# Altium project M-Watch_Project.PrjPcb
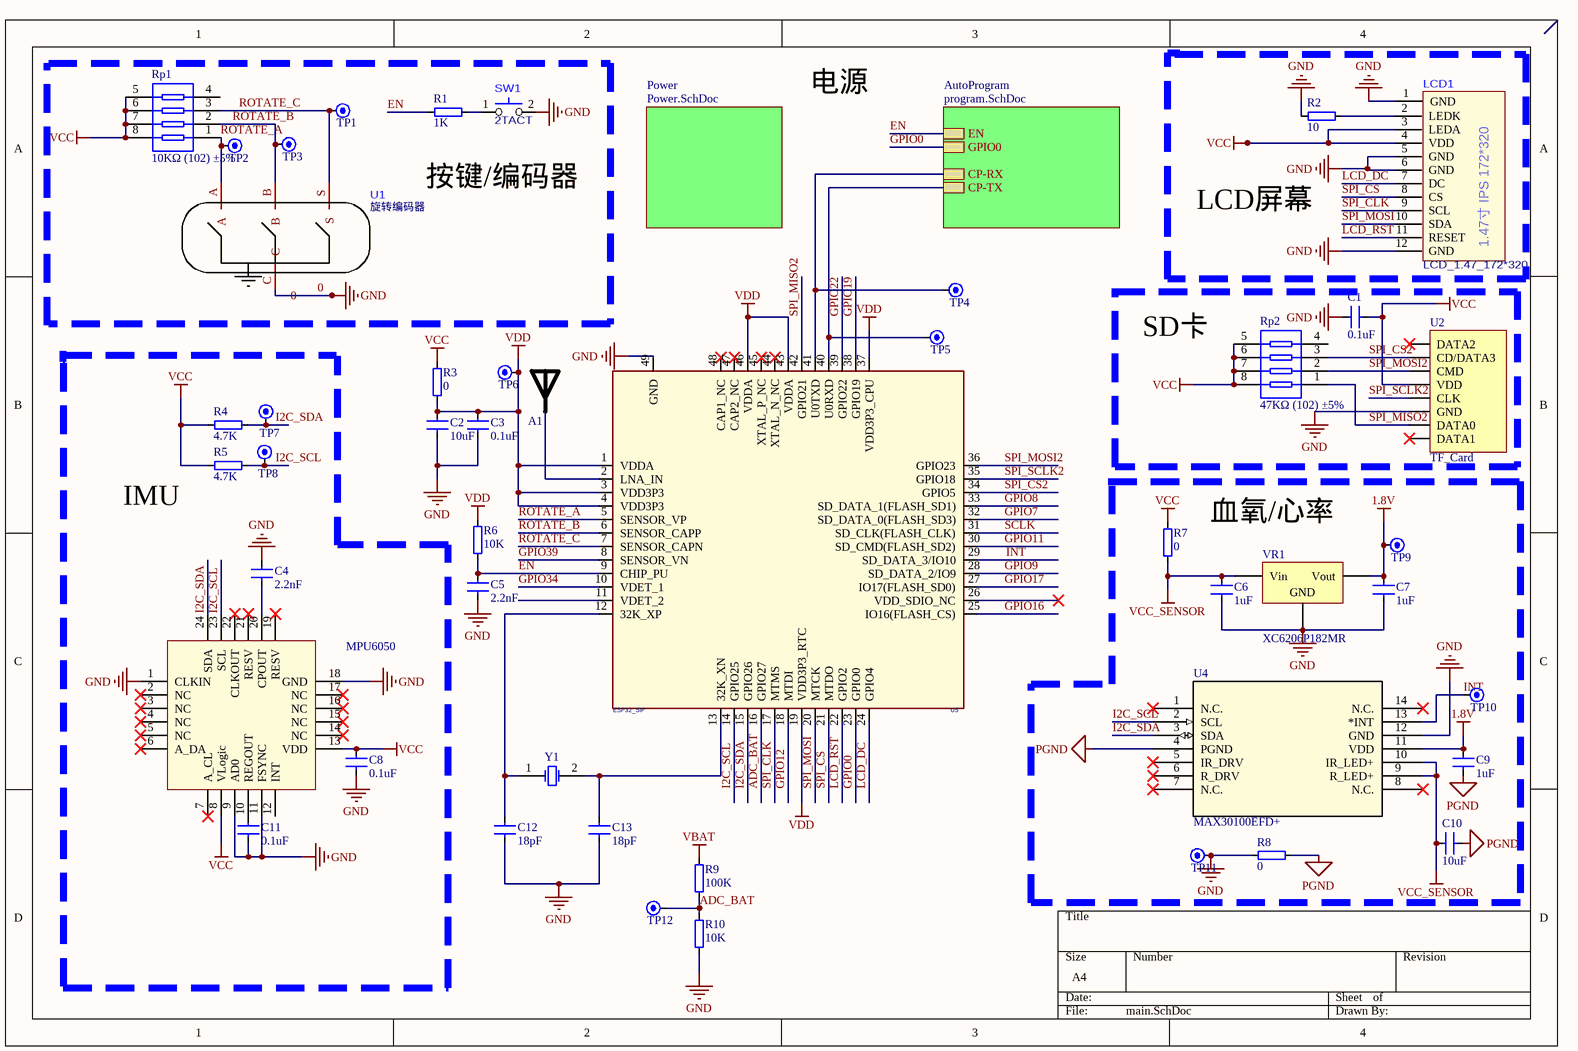
[diagram p0: main.SchDoc]
3 sheets, 95 parts. Net scope: hierarchical (ports join the sheet entries above them; power ports are global).
Board file: M-Watch.PcbDoc
Sheets:
  main.SchDoc
    Power = Power.SchDoc
    AutoProgram = program.SchDoc

## Sheet main.SchDoc
size A4

### Parts
A1  RAINSUN  [ANT-Rainsun-AN5120]  (value not drawn)
C1  0.1uF  [C0402]
C2  10uF  [C0402]
C3  0.1uF  [C0402]
C4  2.2nF  [C0402]
C5  2.2nF  [C0402]
C6  1uF  [C0402]
C7  1uF  [C0402]
C8  0.1uF  [C0402]
C9  1uF  [C0402]
C10  10uF  [C0402]
C11  0.1uF  [C0402]
C12  18pF  [C0402]
C13  18pF  [C0402]
LCD1  LCD_1.47_172*320  [LCD_1.47_172*320_TOP]
R1  1K  [R0402]
R2  10  [R0402]
R3  0  [R0402]
R4  4.7K  [R0402]
R5  4.7K  [R0402]
R6  10K  [R0402]
R7  0  [R0402]
R8  0  [R0402]
R9  100K  [R0402]
R10  10K  [R0402]
Rp1  10KΩ (102) ±5%  [0402_Rx4]
Rp2  47KΩ (102) ±5%  [0402_Rx4]
SW1  2TACT  [SW-SMD_L3.9-W2.9-LS4.8-EH-A]
TP1  TP  [Test-Point]  (value not drawn)
TP2  TP  [Test-Point]  (value not drawn)
TP3  TP  [Test-Point]  (value not drawn)
TP4  TP  [Test-Point]  (value not drawn)
TP5  TP  [Test-Point]  (value not drawn)
TP6  TP  [Test-Point]  (value not drawn)
TP7  TP  [Test-Point]  (value not drawn)
TP8  TP  [Test-Point]  (value not drawn)
TP9  TP  [Test-Point]  (value not drawn)
TP10  TP  [Test-Point]  (value not drawn)
TP11  TP  [Test-Point]  (value not drawn)
TP12  TP  [Test-Point]  (value not drawn)
U1  旋转编码器  [SW-SMD_SIQ-02FVS3_1]
U2  TF_Card  [TF_CARD_MINI]
U3  MPU6050  [QFN-24]
U4  MAX30100EFD+  [21-0880B_MXM]
U5  ESP32_SIP  [QFN-48_7X7]
VR1  XC6206P182MR  [SOT-23-3L]
Y1  32.768KHz ±20ppm 12.5pF  [SMD-3215_2P FC - 135]  (value not drawn)

### Sub-sheets
AutoProgram = program.SchDoc: EN, GPIO0, CP-RX, CP-TX
Power = Power.SchDoc: no entries

### Nets
1.8V: C7.1 C9.1 TP9.1(Test_Point) U4.11(VDD) VR1.2(Vout)
GND: C1.2 C2.2 C3.2 C4.1 C5.2 C6.2 C7.2 C8.2 C11.2 C12.2 C13.2 LCD1.1(GND) LCD1.5(GND) LCD1.6(GND) LCD1.12(GND) R2.1 R8.2 R10.2 SW1.2 TP11.1(Test_Point) U1.0 U1.C U2.6(GND) U3.1(CLKIN) U3.9(AD0) U3.11(FSYNC) U3.18(GND) U4.12(GND) U5.49(GND) VR1.1(GND)
PGND: C9.2 C10.1 R8.1 U4.4(PGND)
VBAT: R9.1
VCC: C1.1 C8.1 LCD1.3(LEDA) LCD1.4(VDD) R3.2 R4.2 R5.2 R7.2 Rp1.5 Rp1.6 Rp1.7 Rp1.8 Rp2.5 Rp2.6 Rp2.7 Rp2.8 U2.4(VDD) U3.8(VLogic) U3.13(VDD)
VCC_SENSOR: C6.1 C10.2 R7.1 U4.9(R_LED+) U4.10(IR_LED+) VR1.3(Vin)
VDD: C2.1 C3.1 R3.1 R6.2 TP6.1(Test_Point) U5.1(VDDA) U5.3(VDD3P3) U5.4(VDD3P3) U5.19(VDD3P3_RTC) U5.37(VDD3P3_CPU) U5.43(VDDA) U5.46(VDDA)
ADC_BAT: R9.2 R10.1 TP12.1(Test_Point) U5.16(GPIO27)
EN: C5.1 R1.2 R6.1 U5.9(CHIP_PU) ; sheet AutoProgram/EN
GPIO0: U5.23(GPIO0) ; sheet AutoProgram/GPIO0
GPIO7: U5.32(SD_DATA_0(FLASH_SD3))
GPIO8: U5.33(SD_DATA_1(FLASH_SD1))
GPIO9: U5.28(SD_DATA_2/IO9)
GPIO11: U5.30(SD_CMD(FLASH_SD2))
GPIO12: U5.18(MTDI)
GPIO16: U5.25(IO16(FLASH_CS))
GPIO17: U5.27(IO17(FLASH_SD0))
GPIO19: U5.38(GPIO19)
GPIO22: U5.39(GPIO22)
GPIO34: U5.10(VDET_1)
GPIO39: U5.8(SENSOR_VN)
I2C_SCL: R5.1 TP8.1(Test_Point) U3.23(SCL) U4.2(SCL) U5.14(GPIO25)
I2C_SDA: R4.1 TP7.1(Test_Point) U3.24(SDA) U4.3(SDA) U5.15(GPIO26)
INT: TP10.1(Test_Point) U4.13(*INT) U5.29(SD_DATA_3/IO10)
LCD_DC: LCD1.7(DC) U5.24(GPIO4)
LCD_RST: LCD1.11(RESET) U5.22(GPIO2)
ROTATE_A: Rp1.1 TP2.1(Test_Point) U1.A U5.5(SENSOR_VP)
ROTATE_B: Rp1.2 TP3.1(Test_Point) U1.B U5.6(SENSOR_CAPP)
ROTATE_C: Rp1.3 TP1.1(Test_Point) U1.S U5.7(SENSOR_CAPN)
SCLK: U5.31(SD_CLK(FLASH_CLK))
SPI_CLK: LCD1.9(SCL) U5.17(MTMS)
SPI_CS: LCD1.8(CS) U5.21(MTDO)
SPI_CS2: Rp2.3 U2.2(CD/DATA3) U5.34(GPIO5)
SPI_MISO2: Rp2.1 U2.7(DATA0) U5.42(GPIO21)
SPI_MOSI: LCD1.10(SDA) U5.20(MTCK)
SPI_MOSI2: Rp2.2 U2.3(CMD) U5.36(GPIO23)
SPI_SCLK2: U2.5(CLK) U5.35(GPIO18)
NetA1_1: A1.1 U5.2(LNA_IN)
NetC4_2: C4.2 U3.20(CPOUT)
NetC11_1: C11.1 U3.10(REGOUT)
NetC12_1: C12.1 U5.12(32K_XP) Y1.1(OSC1)
NetC13_1: C13.1 U5.13(32K_XN) Y1.2(OSC2)
NetLCD1_2: LCD1.2(LEDK) R2.2
NetR1_1: R1.1 SW1.1
NetR23_2: TP5.1(Test_Point) U5.40(U0RXD) ; sheet AutoProgram/CP-TX
NetTP4_1: TP4.1(Test_Point) U5.41(U0TXD) ; sheet AutoProgram/CP-RX

Not connected (* = marked no-connect by the designer): Rp1 4; Rp2 4; U2 1(DATA2)* 8(DATA1)*; U3 2(NC)* 3(NC)* 4(NC)* 5(NC)* 6(A_DA)* 7(A_CL)* 12(INT) 14(NC)* 15(NC)* 16(NC)* 17(NC)* 19(RESV)* 21(RESV)* 22(CLKOUT)*; U4 1(N.C.)* 5(IR_DRV)* 6(R_DRV)* 7(N.C.)* 8(N.C.)* 14(N.C.)*; U5 11(VDET_2) 26(VDD_SDIO_NC)* 44(XTAL_N_NC)* 45(XTAL_P_NC)* 47(CAP2_NC)* 48(CAP1_NC)*

### Notes on the sheet
- 电源
- 按键/编码器
- LCD屏幕
- SD卡
- IMU
- 血氧/心率
- (in symbol LCD_1.47_172*320) 1.47寸 IPS 172*320

### Library data of the parts
A1 = ANT-Rainsun-AP5120
C1-C13 = CAP
R1-R10 = RES: PAKING: 0603; Precision: 5%
Rp1 Rp2 = 0402*4 1KΩ (102) 5%: 贴片排阻; ComponentLink1Description: 供应商链接; ComponentLink1URL: http://www.szlcsc.com/product/details_26469.html; Package: 0402*4; Supplier: LC; SuppliersPartNumber: C25726
SW1 = YD-3410
U1 = SIQ-02FVS3_1
U3 = MPU6050: 六轴传感器
U4 = MAX30100EFD+: No Description Available; Mfr_Name: Maxim Integrated Products; Copyright: Copyright (C) 2022 Ultra Librarian. All rights reserved.; Manufacturer_Part_Number: MAX30100EFD+; RefDes: RefDes; Type: DEV
U5 = ESP32-PICO
VR1 = SOT-23 XC6206P332MR: 低压差线性稳压(LDO); ComponentLink1Description: 供应商链接; ComponentLink1URL: http://www.szlcsc.com/product/details_5896.html; Package: SOT-23; Supplier: LC; SuppliersPartNumber: C5446
Y1 = SMD-3215_2P 32.768KHz 20ppm 12.5pF: 贴片晶振; ComponentLink1Description: 供应商链接; ComponentLink1URL: http://www.szlcsc.com/product/details_33310.html; Package: SMD-3215_2P; Supplier: LC; SuppliersPartNumber: C32346

## Sheet Power.SchDoc
size A4
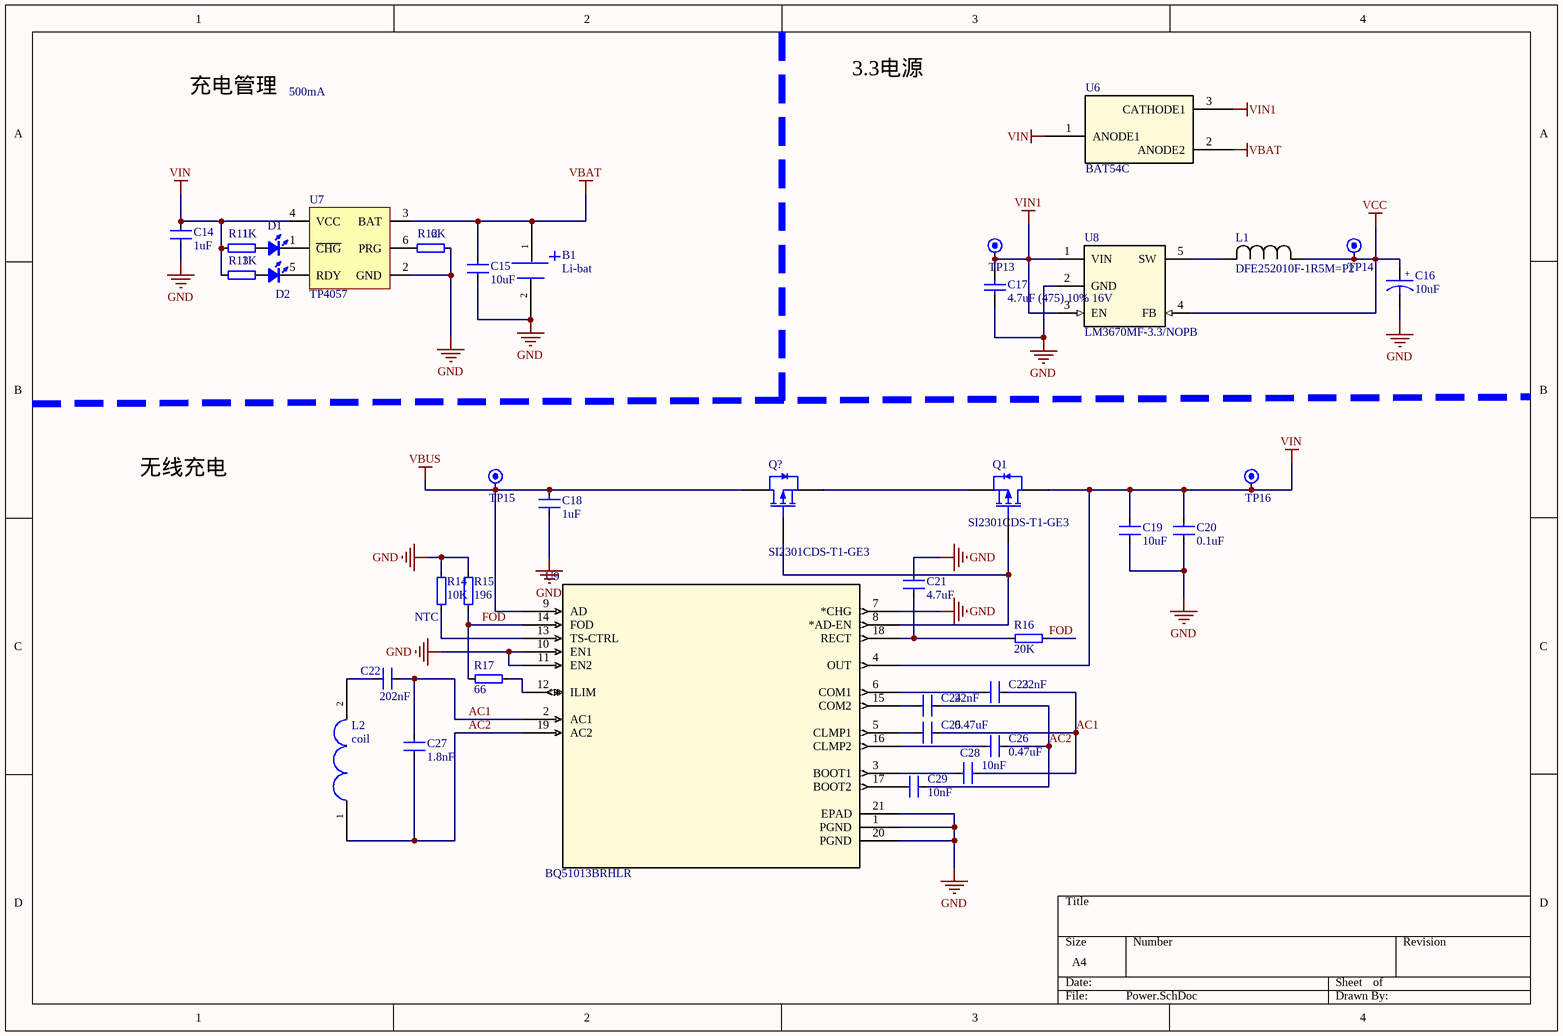
[diagram p1: Power.SchDoc]

### Parts
B1  Li-bat  [bat_li]
C14  1uF  [C0402]
C15  10uF  [C0402]
C16  10uF  [C-A]
C17  4.7uF (475) 10% 16V  [0603_C]
C18  1uF  [C0402]
C19  10uF  [C0402]
C20  0.1uF  [C0402]
C21  4.7uF  [C1206]
C22  202nF  [C0402]
C23  22nF  [C0402]
C24  22nF  [C0402]
C25  0.47uF  [C0402]
C26  0.47uF  [C0402]
C27  1.8nF  [C0402]
C28  10nF  [C0402]
C29  10nF  [C0402]
D1  color?  [LED_0402_RED]  (value not drawn)
D2  color?  [LED_0402_RED]  (value not drawn)
L1  DFE252010F-1R5M=P2  [IND_DFE252010F-1R5M=P2_MUR-M]
L2  coil  [bat_li]
Q1  SI2301CDS-T1-GE3  [SOT-23(SOT-23-3)]
Q?  SI2301CDS-T1-GE3  [SOT-23(SOT-23-3)]
R11  1K  [R0402]
R12  6K  [R0402]
R13  1K  [R0402]
R14  10K  PAKING: NTC  [R0402]
R15  196  [R0402]
R16  20K  [R0402]
R17  66  [R0402]
TP13  TP  [Test-Point]  (value not drawn)
TP14  TP  [Test-Point]  (value not drawn)
TP15  TP  [Test-Point]  (value not drawn)
TP16  TP  [Test-Point]  (value not drawn)
U6  BAT54C  [SOT23_NEX-L]
U7  TP4057  [SOT23-6]
U8  LM3670MF-3.3/NOPB  [SOT23-5]
U9  BQ51013BRHLR  [RHL20_2P05X3P05]

### Nets
GND: B1.2 C14.2 C15.2 C16.2 C17.1 C18.2 C19.2 C20.2 C21.1 R12.2 R14.2 R15.1 U7.2(GND) U8.2(GND) U9.1(PGND) U9.7(*CHG) U9.10(EN1) U9.11(EN2) U9.20(PGND) U9.21(EPAD)
VBAT: B1.1 C15.1 U6.2(ANODE2) U7.3(BAT)
VBUS: C18.1 Q?.3(D) TP15.1(Test_Point) U9.9(AD)
VCC: C16.1 L1.1 TP14.1(Test_Point) U8.4(FB)
VIN: C14.1 C19.1 C20.1 Q1.3(D) R11.1 R13.1 TP16.1(Test_Point) U6.1(ANODE1) U7.4(VCC) U9.4(OUT)
VIN1: C17.2 TP13.1(Test_Point) U6.3(CATHODE1) U8.1(VIN) U8.3(EN)
AC1: C22.2 C23.2 C25.2 C27.2 C28.2 U9.2(AC1)
AC2: C24.2 C26.2 C27.1 C29.1 L2.1 U9.19(AC2)
FOD: R15.2 R16.1 R17.2 U9.14(FOD)
NetC21_2: C21.2 R16.2 U9.18(RECT)
NetC22_1: C22.1 L2.2
NetC23_1: C23.1 U9.6(COM1)
NetC24_1: C24.1 U9.15(COM2)
NetC25_1: C25.1 U9.5(CLMP1)
NetC26_1: C26.1 U9.16(CLMP2)
NetC28_1: C28.1 U9.3(BOOT1)
NetC29_2: C29.2 U9.17(BOOT2)
NetD1_1: D1.1(A) R11.2
NetD1_2: D1.2(K) U7.1(~{CHG})
NetD2_1: D2.1(A) R13.2
NetD2_2: D2.2(K) U7.5(RDY)
NetL1_2: L1.2 U8.5(SW)
NetQ1_1: Q1.1(G) Q?.1(G) U9.8(*AD-EN)
NetQ1_2: Q1.2(S) Q?.2(S)
NetR12_1: R12.1 U7.6(PRG)
NetR14_1: R14.1 U9.13(TS-CTRL)
NetR17_1: R17.1 U9.12(ILIM)

### Notes on the sheet
- 充电管理
- 500mA
- 3.3电源
- 无线充电
- (in symbol CAP-T) +

### Library data of the parts
C14 C15 C18-C29 = CAP
C16 = CAP-T: 钽电容
C17 = 0603 4.7uF (475) 10% 16V: 贴片电容; ComponentLink1Description: 供应商链接; ComponentLink1URL: http://www.szlcsc.com/product/details_20375.html; Package: 0603; Supplier: LC; SuppliersPartNumber: C19666
D1 D2 = LED_0402: LED; Type: 0402; Value: color?
L1 = DFE252010F-1R5M=P2: No Description Available; Mfr_Name: Murata; Type: DEV; Copyright: Copyright (C) 2022 Ultra Librarian. All rights reserved.; Manufacturer_Part_Number: DFE252010F-1R5M=P2; RefDes: RefDes
L2 = L
Q1 Q? = SI2301CDS-T1-GE3: MOS(场效应管); ComponentLink1Description: 供应商链接; ComponentLink1URL: http://www.szlcsc.com/product/details_11030.html; Package: SOT-23(SOT-23-3); Supplier: LC; SuppliersPartNumber: C10487
R11-R13 R15-R17 = RES: PAKING: 0603; Precision: 5%
R14 = RES: Precision: 5%
U6 = BAT54C: No Description Available; Mfr_Name: Nexperia; Copyright: Copyright (C) 2022 Ultra Librarian. All rights reserved.; Manufacturer_Part_Number: BAT54C; RefDes: RefDes; Type: DEV
U8 = LM3670MF-3.3/NOPB: No Description Available; Mfr_Name: Texas Instruments; Type: DEV; RefDes: RefDes; Copyright: Copyright (C) 2022 Ultra Librarian. All rights reserved.; Manufacturer_Part_Number: LM3670MF-3.3/NOPB
U9 = BQ51013BRHLR: No Description Available; Mfr_Name: Texas Instruments; Copyright: Copyright (C) 2022 Ultra Librarian. All rights reserved.; Manufacturer_Part_Number: BQ51013BRHLR; RefDes: RefDes; Type: DEV

## Sheet program.SchDoc
size A4
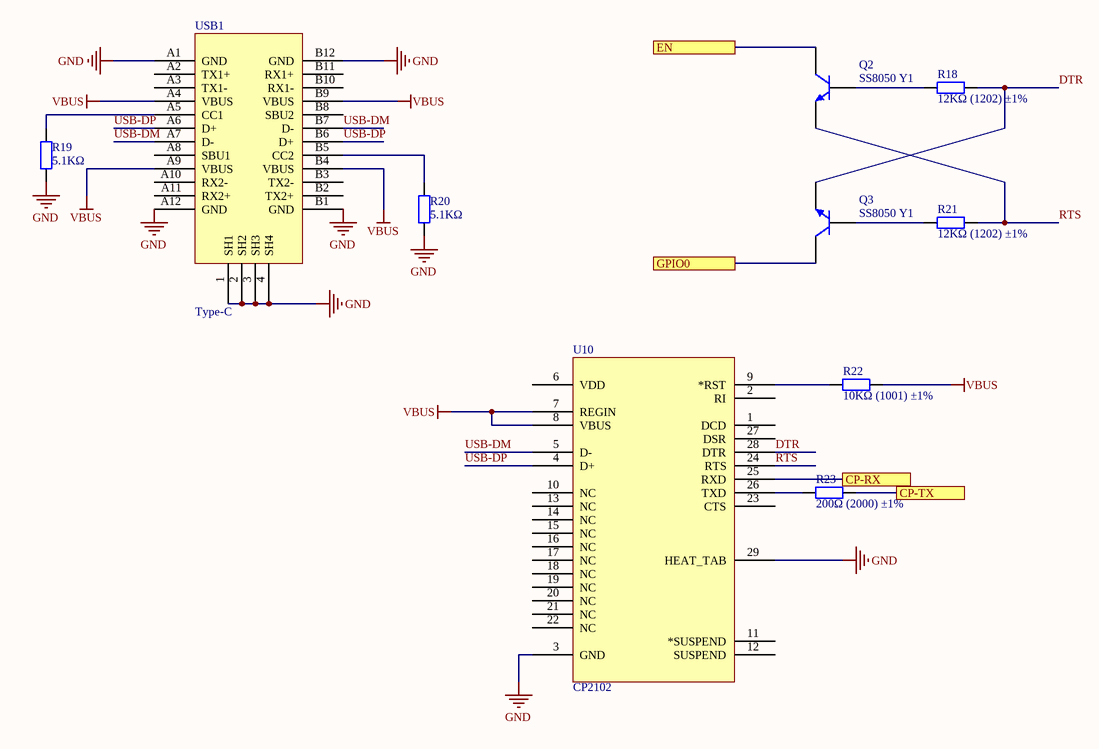
[diagram p2: program.SchDoc]

### Parts
Q2  SS8050 Y1  [SOT-23(SOT-23-3)]
Q3  SS8050 Y1  [SOT-23(SOT-23-3)]
R18  12KΩ (1202) ±1%  [0402_R]
R19  5.1KΩ  [0402_R]
R20  5.1KΩ  [0402_R]
R21  12KΩ (1202) ±1%  [0402_R]
R22  10KΩ (1001) ±1%  [0402_R]
R23  200Ω (2000) ±1%  [0402_R]
U10  CP2102  [QFN-28]
USB1  Type-C  [Type-C-TOP]

### Ports
CP-RX, CP-TX, EN, GPIO0

### Nets
GND: R19.1 R20.1 U10.3(GND) U10.29(HEAT_TAB) USB1.1(SH1) USB1.2(SH2) USB1.3(SH3) USB1.4(SH4) USB1.A1(GND) USB1.A12(GND) USB1.B1(GND) USB1.B12(GND)
VBUS: R22.2 U10.7(REGIN) U10.8(VBUS) USB1.A4(VBUS) USB1.A9(VBUS) USB1.B4(VBUS) USB1.B9(VBUS)
DTR: Q3.2(E) R18.2 U10.28(DTR)
EN: Q2.3(C) ; port EN
GPIO0: Q3.3(C) ; port GPIO0
RTS: Q2.2(E) R21.2 U10.24(RTS)
USB-DM: U10.5(D-) USB1.A7(D-) USB1.B7(D-)
USB-DP: U10.4(D+) USB1.A6(D+) USB1.B6(D+)
NetQ2_1: Q2.1(B) R18.1
NetQ3_1: Q3.1(B) R21.1
NetR19_2: R19.2 USB1.A5(CC1)
NetR20_2: R20.2 USB1.B5(CC2)
NetR22_1: R22.1 U10.9(*RST)
NetR23_1: R23.1 U10.26(TXD)
NetR23_2: R23.2 ; port CP-TX
NetTP4_1: U10.25(RXD) ; port CP-RX

Not connected (* = marked no-connect by the designer): U10 1(DCD) 2(RI) 6(VDD) 10(NC) 11(*SUSPEND) 12(SUSPEND) 13(NC) 14(NC) 15(NC) 16(NC) 17(NC) 18(NC) 19(NC) 20(NC) 21(NC) 22(NC) 23(CTS) 27(DSR); USB1 A2(TX1+) A3(TX1-) A8(SBU1) A10(RX2-) A11(RX2+) B2(TX2+) B3(TX2-) B8(SBU2) B10(RX1-) B11(RX1+)

### Library data of the parts
Q2 Q3 = SOT-23 SS8050 Y1: 三极管; ComponentLink1Description: 供应商链接; ComponentLink1URL: http://www.szlcsc.com/product/details_2507.html; Package: SOT-23; Supplier: LC; SuppliersPartNumber: C2150
R18 R21 = 0402 12KΩ (1202) 1%: 贴片电阻; ComponentLink1Description: 供应商链接; ComponentLink1URL: http://www.szlcsc.com/product/details_26495.html; Package: 0402; Supplier: LC; SuppliersPartNumber: C25752
R19 R20 = 0402 5.1KΩ (5101) 1%: 贴片电阻; ComponentLink1Description: 供应商链接; ComponentLink1URL: http://www.szlcsc.com/product/details_26648.html; Package: 0402; Supplier: LC; SuppliersPartNumber: C25905
R22 = 0402 1KΩ (1001) 1%: 贴片电阻; ComponentLink1Description: 供应商链接; ComponentLink1URL: http://www.szlcsc.com/product/details_12256.html; Package: 0402; Supplier: LC; SuppliersPartNumber: C11702
R23 = 0402 200Ω (2000) 1%: 贴片电阻; ComponentLink1Description: 供应商链接; ComponentLink1URL: http://www.szlcsc.com/product/details_25830.html; Package: 0402; Supplier: LC; SuppliersPartNumber: C25087
U10 = CP2102: USB转TTL; PART DESC: SINGLE-CHIP USB TO UART BRIDGE, QFN28, RoHS.; MFG #1: SILICON LABS; PART NUMBER: CP2102; Value: Value; RefDes: RefDes; Type: DEV
USB1 = USB-Type-C-TOP

## Nets that join several sheets
GND: main (30 pins), Power (20 pins), program (12 pins)
VBAT: main (R9.1), Power (B1.1 C15.1 U6.2 U7.3)
VBUS: Power (C18.1 Q?.3 TP15.1 U9.9), program (7 pins)
VCC: main (19 pins), Power (C16.1 L1.1 TP14.1 U8.4)
EN: main (C5.1 R1.2 R6.1 U5.9), program (Q2.3)
GPIO0: main (U5.23), program (Q3.3)
NetR23_2: main (TP5.1 U5.40), program (R23.2)
NetTP4_1: main (TP4.1 U5.41), program (U10.25)